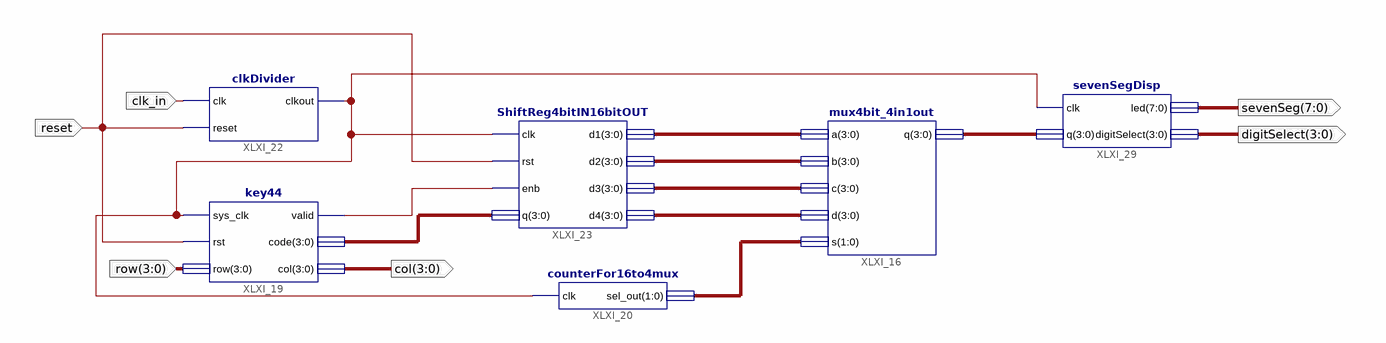
[diagram p0: schematic sheet 1]
// Xilinx ISE schematic top.sch (spartan3e) as structural Verilog: 6 symbols, 6 ports
module top (
  input  [3:0] row,
  input  clk_in,
  input  reset,
  output [3:0] col,
  output [7:0] sevenSeg,
  output [3:0] digitSelect
);

  wire XLXN_83, XLXN_101;
  wire [1:0] XLXN_92;
  wire [3:0] XLXN_82, XLXN_110, XLXN_113, XLXN_114, XLXN_115, XLXN_116;

  mux4bit_4in1out XLXI_16 (.a(XLXN_110), .b(XLXN_113), .c(XLXN_114), .d(XLXN_115), .s(XLXN_92), .q(XLXN_116));
  counterFor16to4mux XLXI_20 (.clk(XLXN_101), .sel_out(XLXN_92));
  ShiftReg4bitIN16bitOUT XLXI_23 (
    .clk(XLXN_101), .rst(reset), .enb(XLXN_83), .q(XLXN_82), .d1(XLXN_110), .d2(XLXN_113), .d3(XLXN_114),
    .d4(XLXN_115));
  key44 XLXI_19 (.sys_clk(XLXN_101), .rst(reset), .row(row), .valid(XLXN_83), .code(XLXN_82), .col(col));
  clkDivider XLXI_22 (.clk(clk_in), .reset(reset), .clkout(XLXN_101));
  sevenSegDisp XLXI_29 (.clk(XLXN_101), .q(XLXN_116), .led(sevenSeg), .digitSelect(digitSelect));
endmodule
